# Altium schematic sheet UV_LED.SchDoc
size A; SheetNumber: 1; SheetTotal: 1
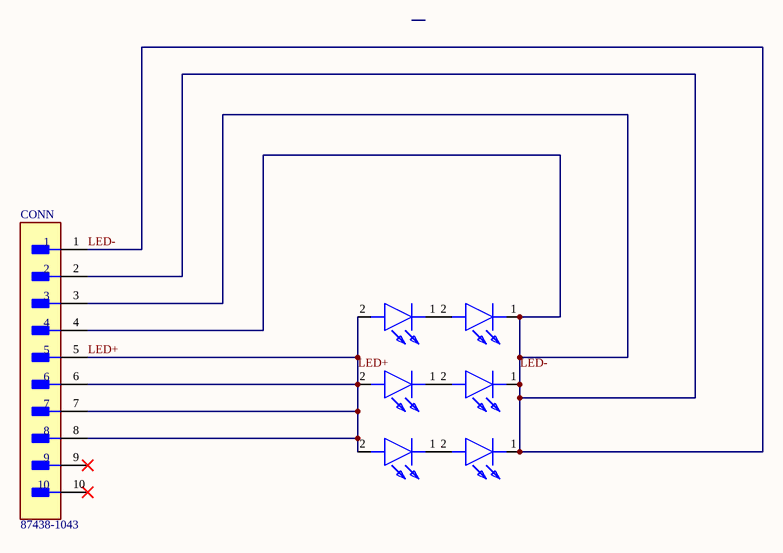
[diagram p0: UV_LED.SchDoc]

## Parts
CONN  87438-1043  [FP-87438-1043-MFG]
LED_1-1  1A 3.2V  [L1F3U380100004001]  (value not drawn)
LED_1-2  1A 3.2V  [L1F3U380100004001]  (value not drawn)
LED_2-1  1A 3.2V  [L1F3U380100004001]  (value not drawn)
LED_2-2  1A 3.2V  [L1F3U380100004001]  (value not drawn)
LED_3-1  1A 3.2V  [L1F3U380100004001]  (value not drawn)
LED_3-2  1A 3.2V  [L1F3U380100004001]  (value not drawn)

## Nets
LED+: CONN.5 CONN.6 CONN.7 CONN.8 LED_1-1.2(A) LED_2-1.2(A) LED_3-1.2(A)
LED-: CONN.1 CONN.2 CONN.3 CONN.4 LED_1-2.1(K) LED_2-2.1(K) LED_3-2.1(K)
NetLED_1-1_1: LED_1-1.1(K) LED_1-2.2(A)
NetLED_2-1_1: LED_2-1.1(K) LED_2-2.2(A)
NetLED_3-1_1: LED_3-1.1(K) LED_3-2.2(A)

Not connected (* = marked no-connect by the designer): CONN 9* 10*

## Library data of the parts
CONN = CMP-04776-000584-1: CONN HEADER SMD R/A 10POS 1.5MM; Current Rating: 2.5A; Voltage Rating (DC): 350V; Gender: Male; Mating Cycles: 10; Contact Resistance: 40mR; Insulation Resistance: 1GR; Glow Wire Compliant: Non-compliant; Voltage Rating: 250V; Packaging: Tape and Reel; Mount: Surface Mount; Termination: SMD/SMT; Contact Plating: Tin; Pitch: 1.5mm; Lead Free: Contains Lead; Housing Color: Beige; Color: Natural; Housing Material: Thermoplastic; RoHS Compliant: Yes; Voltage Rating (AC): 350V; Package Quantity: 6000; Contact Material: Brass; Radiation Hardening: No; Max Voltage Rating (AC): 350V; Flammability Rating: UL94 V-0; Min Operating Temperature: -55°C; Material: Nylon; Number of Circuits: 10; Number of Contacts: 10; Series: Pico-SPOX; Orientation: Right Angle; Max Operating Temperature: 105°C; Number of Rows: 1; Number of Positions: 10; Lead Pitch: 1.5mm
LED_1-1 LED_1-2 LED_2-1 LED_2-2 LED_3-1 LED_3-2 = L1F3-U380100004001: LED; Manufacturer_Name: Lumileds; Datasheet Link: https://componentsearchengine.com/Datasheets/1/L1F3-U380100004001.pdf; Height: 0.66mm; Manufacturer_Part_Number: L1F3-U380100004001; Mouser Part Number: 997-L1F3U38010401; Mouser Price/Stock: https://www.mouser.co.uk/ProductDetail/Lumileds/L1F3-U380100004001?qs=T3oQrply3y9xGBCGNIciEw%3D%3D; Arrow Part Number: L1F3-U380100004001; Arrow Price/Stock: https://www.arrow.com/en/products/l1f3-u380100004001/lumileds?region=nac